# Altium schematic sheet Sheet_1_2021-11-24.schdoc
size 272 x 181 mm
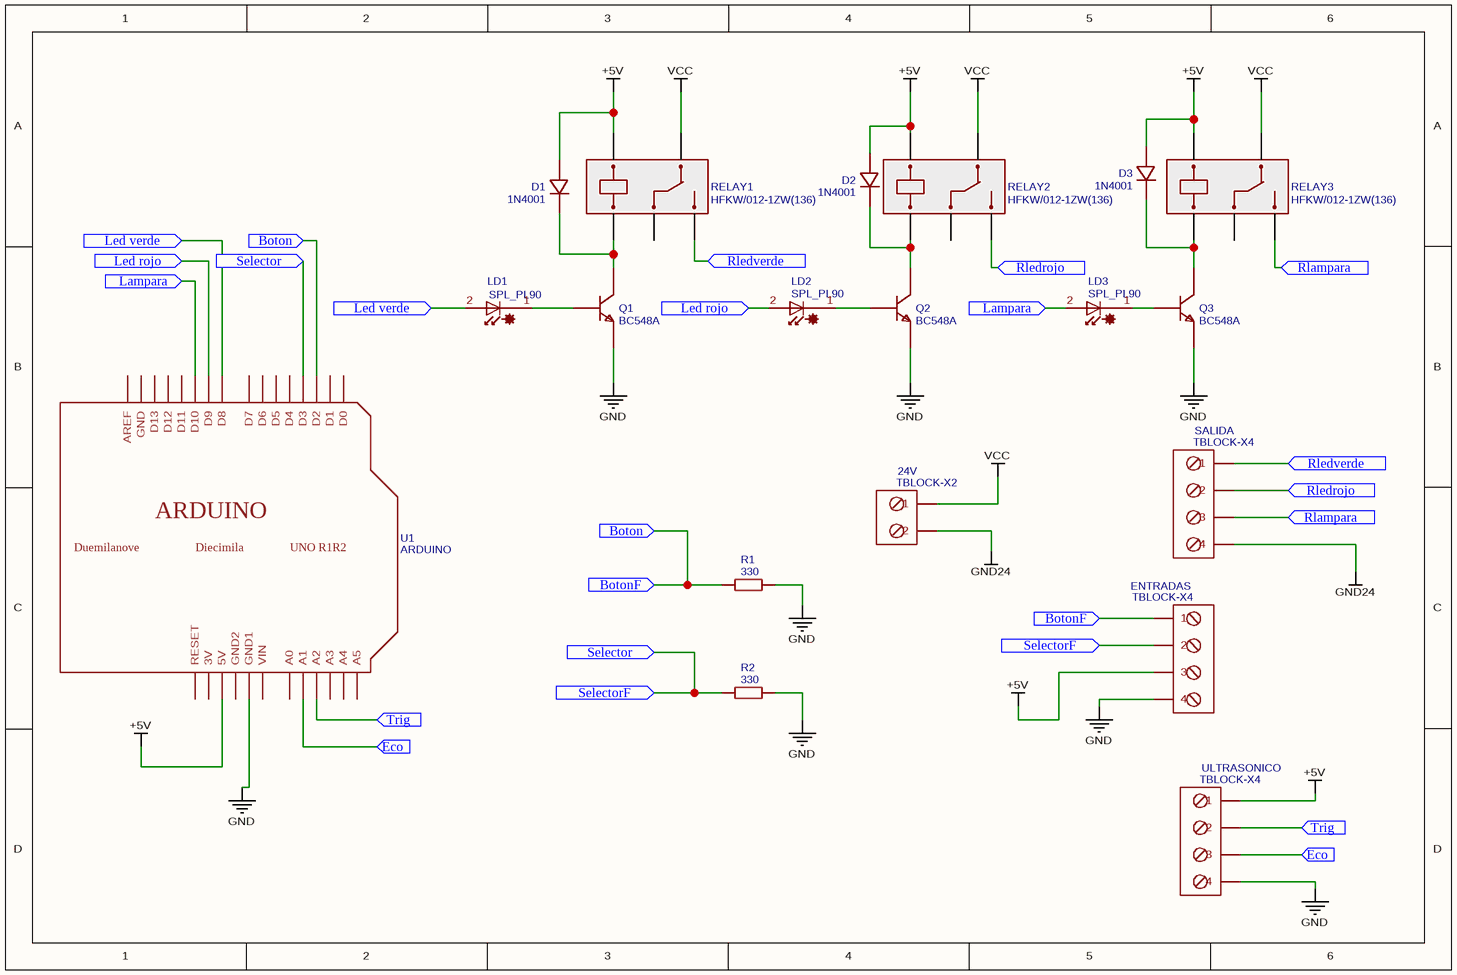
[diagram p0: Sheet_1_2021-11-24.schdoc]

## Parts
24V  TBLOCK-X2  [TBLOCK-X2]
D1  1N4001  [DO-41_BD2.4-L4.7-P8.70-D0.9-RD]
D2  1N4001  [DO-41_BD2.4-L4.7-P8.70-D0.9-RD]
D3  1N4001  [DO-41_BD2.4-L4.7-P8.70-D0.9-RD]
ENTRADAS  TBLOCK-X4  [TBLOCK-X4]
LD1  SPL_PL90  [LED-5MM]
LD2  SPL_PL90  [LED-5MM]
LD3  SPL_PL90  [LED-5MM]
Q1  BC548A  [TO92-INLINE]
Q2  BC548A  [TO92-INLINE]
Q3  BC548A  [TO92-INLINE]
R1  330  [RES-TH_BD2.3-L6.5-P6.9-D0.5]
R2  330  [RES-TH_BD2.3-L6.5-P6.9-D0.5]
RELAY1  HFKW/012-1ZW(136)  [RELAY-HF_24]
RELAY2  HFKW/012-1ZW(136)  [RELAY-HF_24]
RELAY3  HFKW/012-1ZW(136)  [RELAY-HF_24]
SALIDA  TBLOCK-X4  [TBLOCK-X4]
U1  ARDUINO  [ARDUINO-NOHOLE]
ULTRASONICO  TBLOCK-X4  [TBLOCK-X4]

## Ports
Boton (in), BotonF (in), Eco (in), Lampara (in), Led rojo (in), Led verde (in), Rlampara (in), Rledrojo (in), Rledverde (in), Selector (in), SelectorF (in), Trig (in)

## Nets
+5V: D1.2(A) D2.2(A) D3.2(A) ENTRADAS.3 RELAY1.1 RELAY2.1 RELAY3.1 U1.5V ULTRASONICO.1
GND: ENTRADAS.4 Q1.3(E) Q2.3(E) Q3.3(E) R1.2 R2.2 U1.GND1 ULTRASONICO.4
GND24: 24V.2 SALIDA.4
VCC: 24V.1 RELAY1.3 RELAY2.3 RELAY3.3
Boton: ENTRADAS.1 R1.1 U1.D2 ; port Boton, port BotonF
Eco: U1.A1 ULTRASONICO.3 ; port Eco
Lampara: LD3.2(A) U1.D10 ; port Lampara
Led rojo: LD2.2(A) U1.D9 ; port Led rojo
Led verde: LD1.2(A) U1.D8 ; port Led verde
Rlampara: RELAY3.5 SALIDA.3 ; port Rlampara
Rledrojo: RELAY2.5 SALIDA.2 ; port Rledrojo
Rledverde: RELAY1.5 SALIDA.1 ; port Rledverde
Selector: ENTRADAS.2 R2.1 U1.D3 ; port Selector, port SelectorF
Trig: U1.A2 ULTRASONICO.2 ; port Trig
NetD1_1: D1.1(K) Q1.1(C) RELAY1.2
NetD2_1: D2.1(K) Q2.1(C) RELAY2.2
NetD3_1: D3.1(K) Q3.1(C) RELAY3.2
NetLD1_1: LD1.1(C) Q1.2(B)
NetLD2_1: LD2.1(C) Q2.2(B)
NetLD3_1: LD3.1(C) Q3.2(B)

Not connected (* = marked no-connect by the designer): RELAY1 4; RELAY2 4; RELAY3 4; U1 3V A0 A3 A4 A5 AREF D0 D1 D4 D5 D6 D7 D11 D12 D13 GND GND2 RESET VIN

## Notes on the sheet
- (in symbol ARDUINO) Duemilanove; Diecimila; UNO R1R2

## Library data of the parts
24V = TBLOCK-X2: Contributor: ahmedyerli; spicePre: T; spiceSymbolName: TBLOCK-X2
D1-D3 = 1N4001: BOM_Manufacturer: LRC; BOM_Supplier: LCSC; BOM_Manufacturer Part: 1N4001; BOM_Supplier Part: C82804; spicePre: D; spiceSymbolName: 1N4001
ENTRADAS SALIDA ULTRASONICO = TBLOCK-X4: Contributor: ahmedyerli; spicePre: T; spiceSymbolName: TBLOCK-X4
LD1-LD3 = SPL_PL90: Contributor: KiCAD; license: https://www.gnu.org/licenses/lgpl-2.1.html; spicePre: L; spiceSymbolName: SPL_PL90
Q1-Q3 = BC548A: description: Amplifier Transistor NPN Silicon; spicePre: Q; spiceSymbolName: BC548A
R1 R2 = 330: BOM_Manufacturer: Made in China; nameAlias: Resistance (Ohms); Contributor: LCSC; BOM_Supplier: LCSC; BOM_Supplier Part: C10322; BOM_Manufacturer Part: -; spicePre: R; spiceSymbolName: 330Ω (331) ±5%
RELAY1-RELAY3 = HFKW/012-1ZW(136): BOM_Manufacturer: HF; BOM_Manufacturer Part: HFKW/012-1ZW(136); spicePre: R; spiceSymbolName: HFKW/012-1ZW(136)
U1 = ARDUINO: Contributor: Adafruit; spicePre: U; spiceSymbolName: ARDUINO